# EAGLE design rev_002 (EAGLE 9.6.2)
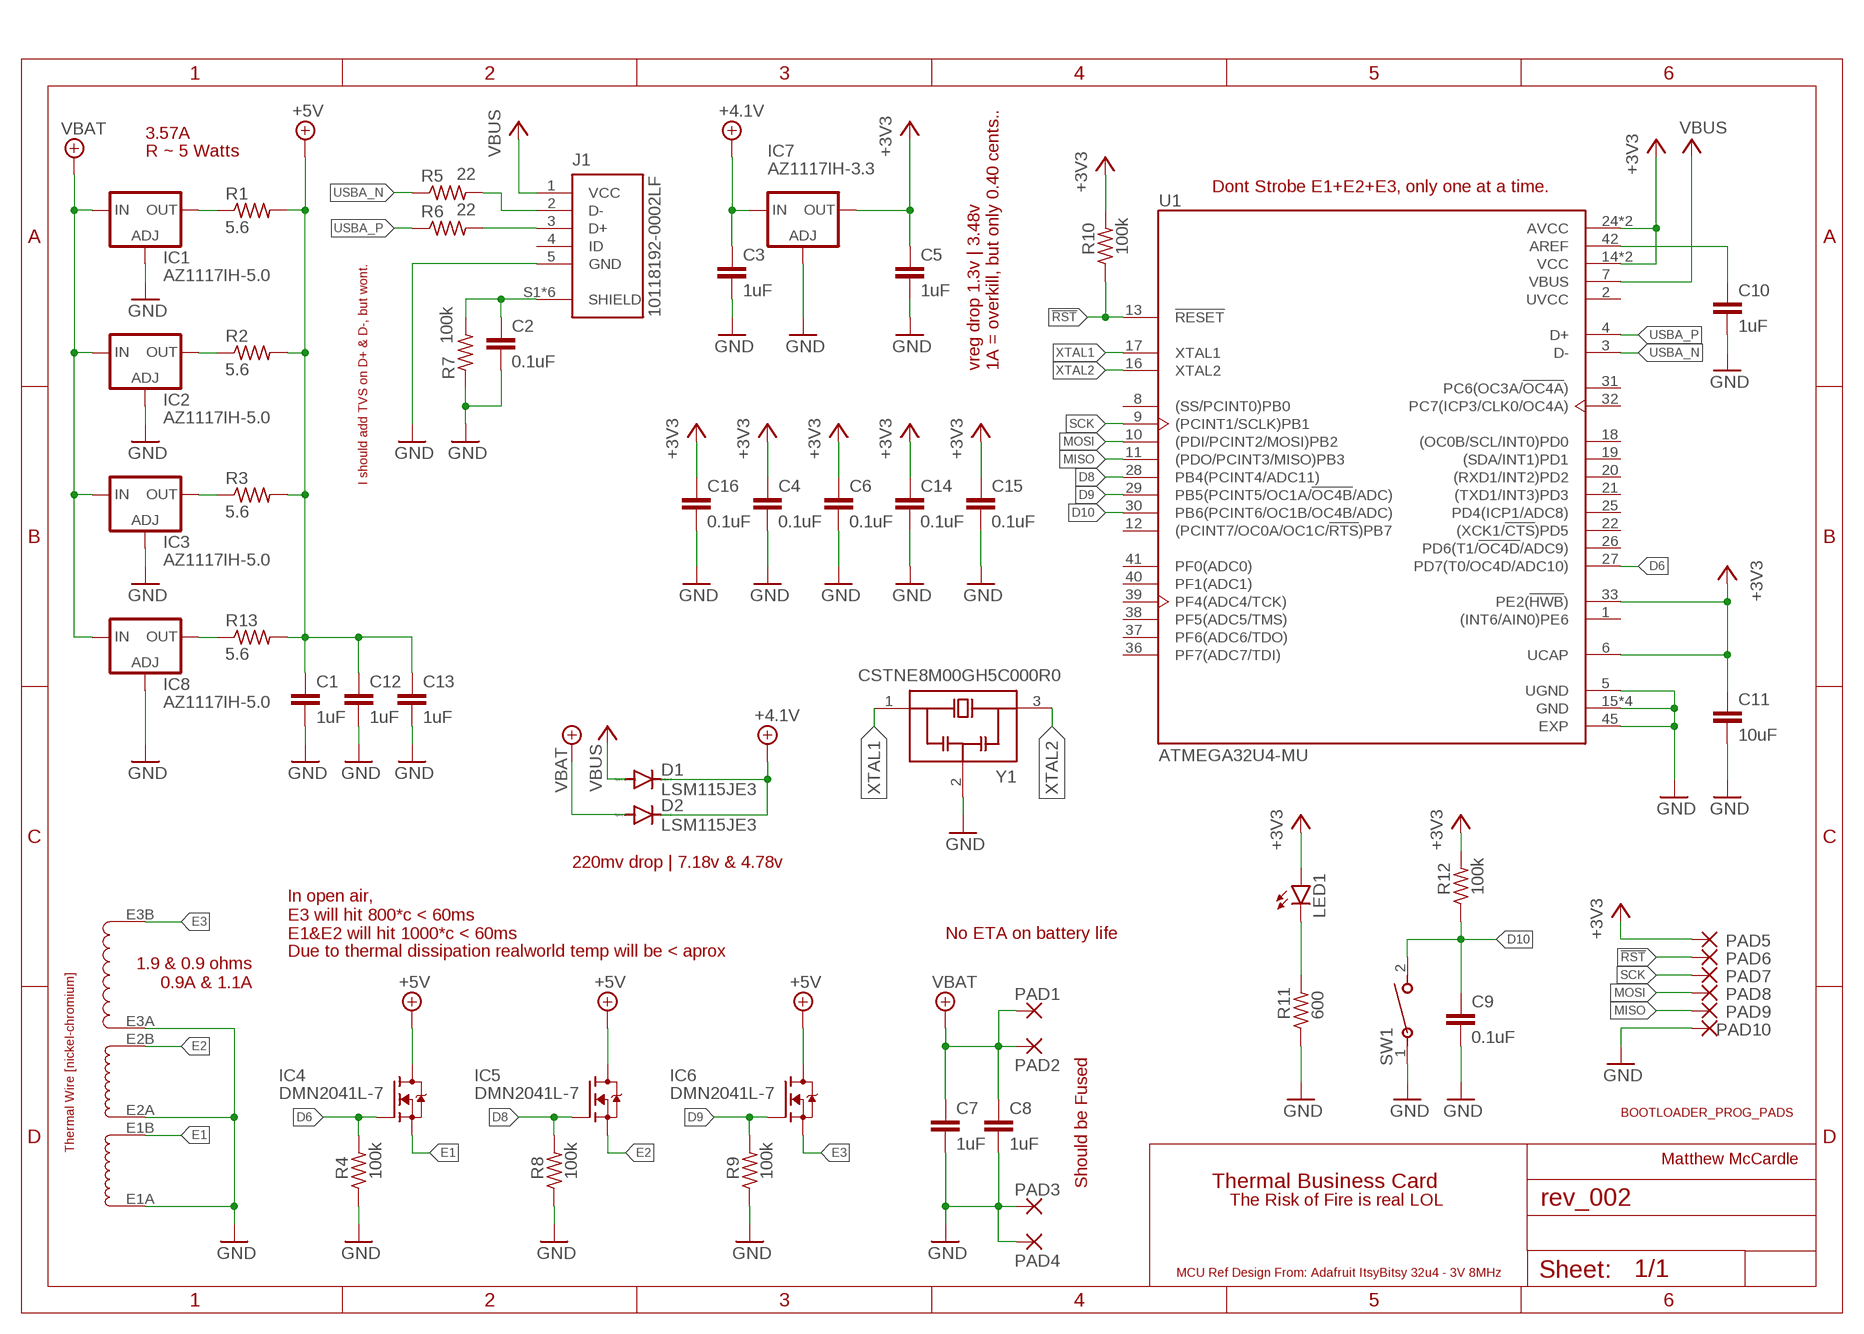
[diagram p0: schematic, sheet 1]

## Parts
C1  1uF  C-EUC0603  [C0603]
C2  0.1uF  C-EUC0603  [C0603]
C3  1uF  C-EUC0603  [C0603]
C4  0.1uF  C-EUC0603  [C0603]
C5  1uF  C-EUC0603  [C0603]
C6  0.1uF  C-EUC0603  [C0603]
C7  1uF  C-EUC0603  [C0603]
C8  1uF  C-EUC0603  [C0603]
C9  0.1uF  C-EUC0603  [C0603]
C10  1uF  C-EUC0603  [C0603]
C11  10uF  C-EUC0603  [C0603]
C12  1uF  C-EUC0603  [C0603]
C13  1uF  C-EUC0603  [C0603]
C14  0.1uF  C-EUC0603  [C0603]
C15  0.1uF  C-EUC0603  [C0603]
C16  0.1uF  C-EUC0603  [C0603]
D1  LSM115JE3  DIODE-DO214BA  [DO214BA]
D2  LSM115JE3  DIODE-DO214BA  [DO214BA]
IC1  AZ1117IH-5.0  AZ1117IH  [SOT223]
IC2  AZ1117IH-5.0  AZ1117IH  [SOT223]
IC3  AZ1117IH-5.0  AZ1117IH  [SOT223]
IC4  DMN2041L-7  DS31126  [SOT23]
IC5  DMN2041L-7  DS31126  [SOT23]
IC6  DMN2041L-7  DS31126  [SOT23]
IC7  AZ1117IH-3.3  AZ1117IH  [SOT223]
IC8  AZ1117IH-5.0  AZ1117IH  [SOT223]
J1  10118192-0002LF  [AMPHENOL_10118192-0002LF]
LED1  LEDSML0603  [SML0603]
NICR1  HOT_WIRE  [LAYOUT_A]
PAD1  WIREPADSMD5-2,5  [5-2,5]
PAD2  WIREPAD2,54/0,9  [2,54/0,9]
PAD3  WIREPAD2,54/0,9  [2,54/0,9]
PAD4  WIREPADSMD5-2,5  [5-2,5]
PAD5  WIREPADSMD1,27-254  [SMD1,27-2,54]
PAD6  WIREPADSMD1,27-254  [SMD1,27-2,54]
PAD7  WIREPADSMD1,27-254  [SMD1,27-2,54]
PAD8  WIREPADSMD1,27-254  [SMD1,27-2,54]
PAD9  WIREPADSMD1,27-254  [SMD1,27-2,54]
PAD10  WIREPADSMD1,27-254  [SMD1,27-2,54]
R1  5.6  R-US_R2512  [R2512]
R2  5.6  R-US_R2512  [R2512]
R3  5.6  R-US_R2512  [R2512]
R4  100k  R-US_R0603  [R0603]
R5  22  R-US_R0603  [R0603]
R6  22  R-US_R0603  [R0603]
R7  100k  R-US_R0603  [R0603]
R8  100k  R-US_R0603  [R0603]
R9  100k  R-US_R0603  [R0603]
R10  100k  R-US_R0603  [R0603]
R11  600  R-US_R0603  [R0603]
R12  100k  R-US_R0603  [R0603]
R13  5.6  R-US_R2512  [R2512]
SW1  B3AL-1000P  [SW_B3AL_OMR]
U1  ATMEGA32U4-MU  [QFN50P700X700X100-45N]
Y1  CSTNE8M00GH5C000R0  [OSC_CSTNE8M00GH5C000R0]

## Nets
!RST: PAD6.1(P) R10.1 U1.13(!RESET!)
+3V3: C4.1 C5.1 C6.1 C11.1 C14.1 C15.1 C16.1 IC7.2(OUT) IC7.4(OUT) LED1.A PAD5.1(P) R10.2 R12.2 U1.6(UCAP) U1.14(VCC) U1.24(AVCC) U1.33(PE2(!HWB!)) U1.34(VCC) U1.44(AVCC)
+4.1V: C3.1 D1.C D2.C IC7.3(IN)
+5V: C1.1 C12.1 C13.1 IC4.D IC5.D IC6.D R1.2 R2.2 R3.2 R13.2
+8V: C7.1 C8.1 D2.A IC1.3(IN) IC2.3(IN) IC3.3(IN) IC8.3(IN) PAD1.1(P) PAD2.1(P) ; supply symbol labelled VBAT
D6: IC4.G R4.2 U1.27(PD7(T0/OC4D/ADC10))
D8: IC5.G R8.2 U1.28(PB4(PCINT4/ADC11))
D9: IC6.G R9.2 U1.29(PB5(PCINT5/OC1A/!OC4B!/ADC))
D10: C9.1 R12.1 SW1.2 U1.30(PB6(PCINT6/OC1B/OC4B/ADC))
E1: IC4.S NICR1.E1B
E2: IC5.S NICR1.E2B
E3: IC6.S NICR1.E3B
GND: C1.2 C2.2 C3.2 C4.2 C5.2 C6.2 C7.2 C8.2 C9.2 C10.2 C11.2 C12.2 C13.2 C14.2 C15.2 C16.2 IC1.1(ADJ) IC2.1(ADJ) IC3.1(ADJ) IC7.1(ADJ) IC8.1(ADJ) J1.5(GND) NICR1.E1A NICR1.E2A NICR1.E3A PAD3.1(P) PAD4.1(P) PAD10.1(P) R4.1 R7.1 R8.1 R9.1 R11.1 SW1.1 U1.5(UGND) U1.15(GND) U1.23(GND) U1.35(GND) U1.43(GND) U1.45(EXP) Y1.2(GND)
MISO: PAD9.1(P) U1.11((PDO/PCINT3/MISO)PB3)
MOSI: PAD8.1(P) U1.10((PDI/PCINT2/MOSI)PB2)
N$1: IC8.2(OUT) IC8.4(OUT) R13.1
N$2: C10.1 U1.42(AREF)
N$4: C2.1 J1.S1(SHIELD) J1.S2(SHIELD) J1.S3(SHIELD) J1.S4(SHIELD) J1.S5(SHIELD) J1.S6(SHIELD) R7.2
N$6: LED1.C R11.2
N$7: IC3.2(OUT) IC3.4(OUT) R3.1
N$9: IC2.2(OUT) IC2.4(OUT) R2.1
N$11: IC1.2(OUT) IC1.4(OUT) R1.1
SCK: PAD7.1(P) U1.9((PCINT1/SCLK)PB1)
USBA_N: R5.1 U1.3(D-)
USBA_P: R6.1 U1.4(D+)
USBB_N: J1.2(D-) R5.2
USBB_P: J1.3(D+) R6.2
VBUS: D1.A J1.1(VCC) U1.7(VBUS)
XTAL1: U1.17(XTAL1) Y1.1(IN)
XTAL2: U1.16(XTAL2) Y1.3(OUT)
Unconnected: J1.4(ID) U1.1((INT6/AIN0)PE6) U1.8((SS/PCINT0)PB0) U1.12((PCINT7/OC0A/OC1C/!RTS!)PB7) U1.18((OC0B/SCL/INT0)PD0) U1.19((SDA/INT1)PD1) U1.20((RXD1/INT2)PD2) U1.21((TXD1/INT3)PD3) U1.22((XCK1/!CTS!)PD5) U1.25(PD4(ICP1/ADC8)) U1.26(PD6(T1/!OC4D!/ADC9)) U1.31(PC6(OC3A/!OC4A!)) U1.32(PC7(ICP3/CLK0/OC4A)) U1.36(PF7(ADC7/TDI)) U1.37(PF6(ADC6/TDO)) U1.38(PF5(ADC5/TMS)) U1.39(PF4(ADC4/TCK)) U1.40(PF1(ADC1)) U1.41(PF0(ADC0))

## Notes on the sheet
- 3.57A
- R ~ 5 Watts
- Dont Strobe E1+E2+E3, only one at a time.
- I should add TVS on D+ & D-, but wont.
- vreg drop 1.3v | 3.48v
  1A = overkill, but only 0.40 cents..
- 220mv drop | 7.18v & 4.78v
- In open air, 
  E3 will hit 800*c < 60ms
  E1&E2 will hit 1000*c < 60ms
- No ETA on battery life
- 1.9 & 0.9 ohms
  0.9A & 1.1A
- Due to thermal dissipation realworld temp will be < aprox
- BOOTLOADER_PROG_PADS
- Thermal Wire [nickel-chromium] | Matthew McCardle
- Should be Fused | Thermal Business Card
- The Risk of Fire is real LOL
- MCU Ref Design From: Adafruit ItsyBitsy 32u4 - 3V 8MHz

## Power pins joined to a net without a drawn wire
UVCC: U1.2(UVCC)

## Library data of the parts
C1-C16 = rcl:C-EU: CAPACITOR, European symbol; SPICEPREFIX: C
D1 D2 = diode:DIODE-: DIODE
IC1-IC3 IC7 IC8 = v-reg-edit:AZ1117IH
IC4-IC6 = ds31126:DS31126
J1 = 10118192-0002LF:10118192-0002LF: USB - micro B USB 2.0 Receptacle Connector 5 Position Surface Mount, Right Angle; DESCRIPTION: Micro USB 2.0, Input Output Connectors, B TYPE RECEPTACLE without flange; DIGI-KEY_PART_NUMBER: 609-5379-1-ND; MF: Amphenol ICC (FCI); MP: 10118192-0002LF; PACKAGE: None; PURCHASE-URL: https://pricing.snapeda.com/search/part/10118192-0002LF/?ref=eda
LED1 = led_edit:LED: LED OSRAM: - CHIPLED LG R971, LG N971, LY N971, LG Q971, LY Q971, LO R971, LY R971 LH N974, LH R974 LS Q976, LO Q976, LY Q976 LO Q996 - Hyper CHIPLED LW Q18S LB Q993, LB Q99A, LB R99A - SideLED LS A670, LO A670, LY A670, LG A670, LP A670 LB A673, LV A673, LT A673, LW A673 LH A674 LY A675 LS A676, LA A676, LO A676, LY A676, LW A676 LS A679, LY A679, LG A679 - Hyper Micro SIDELED® LS Y876, LA Y876, LO Y876, LY Y876 LT Y87S - SmartLED LW L88C, LW L88S LB L89C, LB L89S, LG L890 LS L89K, LO L89K, LY L89K LS L896, LA L896, LO L896, LY L896 - TOPLED LS T670, LO T670, LY T670, LG T670, LP T670 LSG T670, LSP T670, LSY T670, LOP T670, LYG T670 LG T671, LOG T671, LSG T671 LB T673, LV T673, LT T673, LW T673 LH T674 LS T676, LA T676, LO T676, LY T676, LB T676, LH T676, LSB T676, LW T676 LB T67C, LV T67C, LT T67C, LS T67K, LO T67K, LY T67K, LW E67C LS E67B, LA E67B, LO E67B, LY E67B, LB E67C, LV E67C, LT E67C LW T67C LS T679, LY T679, LG T679 LS T770, LO T770, LY T770, LG T770, LP T770 LB T773, LV T773, LT T773, LW T773 LH T774 LS E675, LA E675, LY E675, LS T675 LS T776, LA T776, LO T776, LY T776, LB T776 LHGB T686 LT T68C, LB T68C - Hyper Mini TOPLED® LB M676 - Mini TOPLED Santana® LG M470 LS M47K, LO M47K, LY M47K Source: http://www.osram.convergy.de LUXEON: - LUMILED® LXK2-PW12-R00, LXK2-PW12-S00, LXK2-PW14-U00, LXK2-PW14-V00 LXK2-PM12-R00, LXK2-PM12-S00, LXK2-PM14-U00 LXK2-PE12-Q00, LXK2-PE12-R00, LXK2-PE12-S00, LXK2-PE14-T00, LXK2-PE14-U00 LXK2-PB12-K00, LXK2-PB12-L00, LXK2-PB12-M00, LXK2-PB14-N00, LXK2-PB14-P00, LXK2-PB14-Q00 LXK2-PR12-L00, LXK2-PR12-M00, LXK2-PR14-Q00, LXK2-PR14-R00 LXK2-PD12-Q00, LXK2-PD12-R00, LXK2-PD12-S00 LXK2-PH12-R00, LXK2-PH12-S00 LXK2-PL12-P00, LXK2-PL12-Q00, LXK2-PL12-R00 Source: www.luxeon.com KINGBRIGHT: KA-3528ASYC Source: www.kingbright.com
NICR1 = logo_wire:HOT_WIRE
PAD1-PAD10 = wirepad:WIREPAD: Wire PAD connect wire on PCB
R1-R13 = rcl:R-US_: RESISTOR, American symbol; SPICEPREFIX: R
SW1 = ul_B3AL-1000P:B3AL-1000P; COPYRIGHT: Copyright (C) 2021 Ultra Librarian. All rights reserved.; DIGI-KEY_PART_NUMBER_1: SW1216TR-ND; DIGI-KEY_PART_NUMBER_2: SW1216CT-ND; DIGI-KEY_PART_NUMBER_3: SW1216DKR-ND; MANUFACTURER_PART_NUMBER: B3AL-1000P; MFR_NAME: Omron
U1 = ATMEGA32U4-MU:ATMEGA32U4-MU: 8-bit Microcontrollers - MCU AVR USB 32K FLASH INDUSTRIA; DESCRIPTION: AVR AVR® ATmega Microcontroller IC 8-Bit 16MHz 32KB (16K x 16) FLASH 44-VQFN (7x7); DIGI-KEY_PART_NUMBER: 2156-ATMEGA32U4-MUR-ND; MF: Microchip Technology / Atmel; MP: ATMEGA32U4-MU; PACKAGE: VFQFN-44 Microchip Technology / Atmel; PURCHASE-URL: https://pricing.snapeda.com/search/part/ATMEGA32U4-MU/?ref=eda
Y1 = CSTNE8M00GH5C000R0:CSTNE8M00GH5C000R0: 8MHz Ceramic Resonator Built in Capacitor 33pF ±0.13% 40 Ohms -40°C ~ 125°C Surface Mount; DESCRIPTION: 8 MHz Ceramic Resonator Built in Capacitor 33 pF ±0.13% 40 Ohms -40°C ~ 125°C Surface Mount; DIGI-KEY_PART_NUMBER: 490-17961-1-ND; MF: Murata; MP: CSTNE8M00GH5C000R0; PACKAGE: SMD-3 Murata; PURCHASE-URL: https://pricing.snapeda.com/search/part/CSTNE8M00GH5C000R0/?ref=eda

## Board
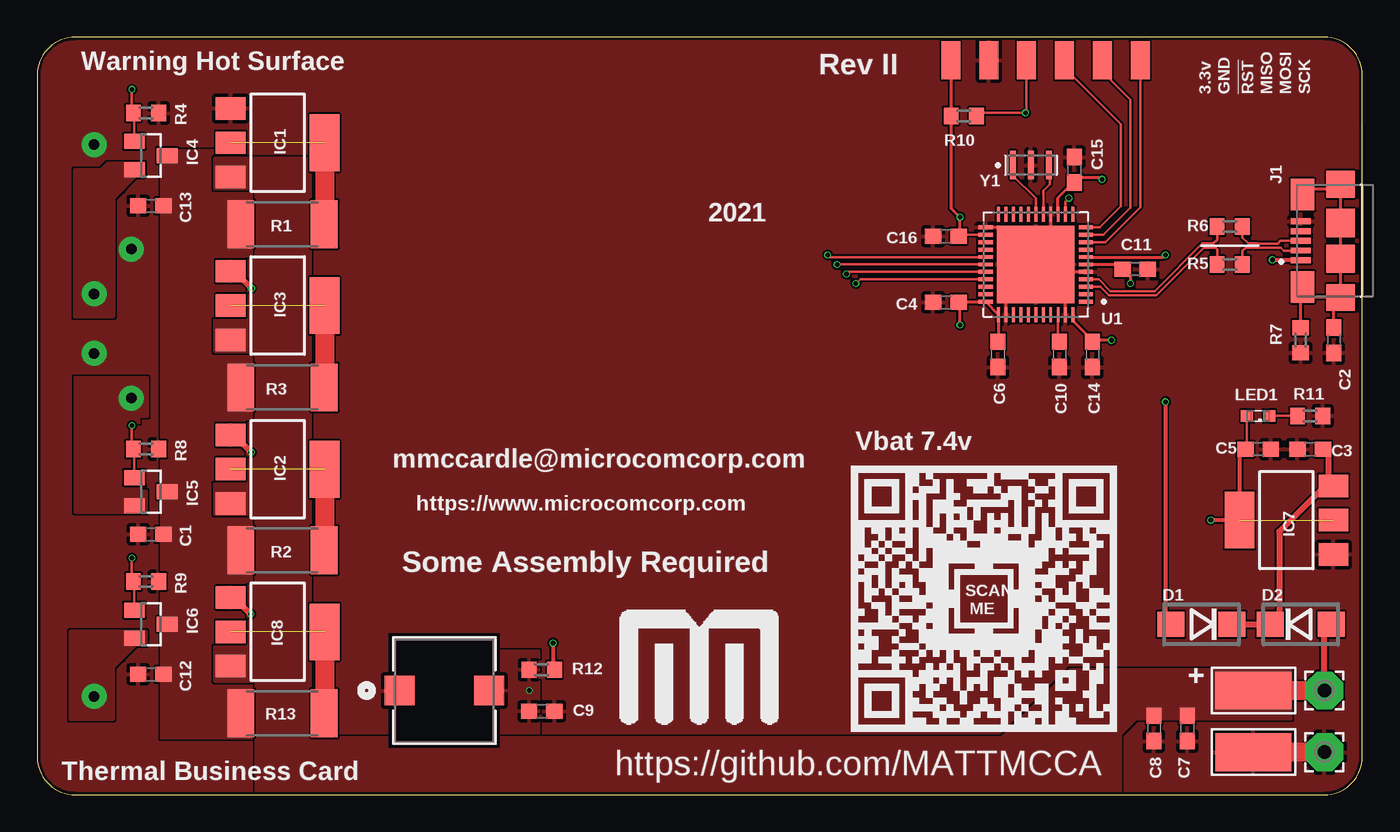
[diagram p1: board, top side]
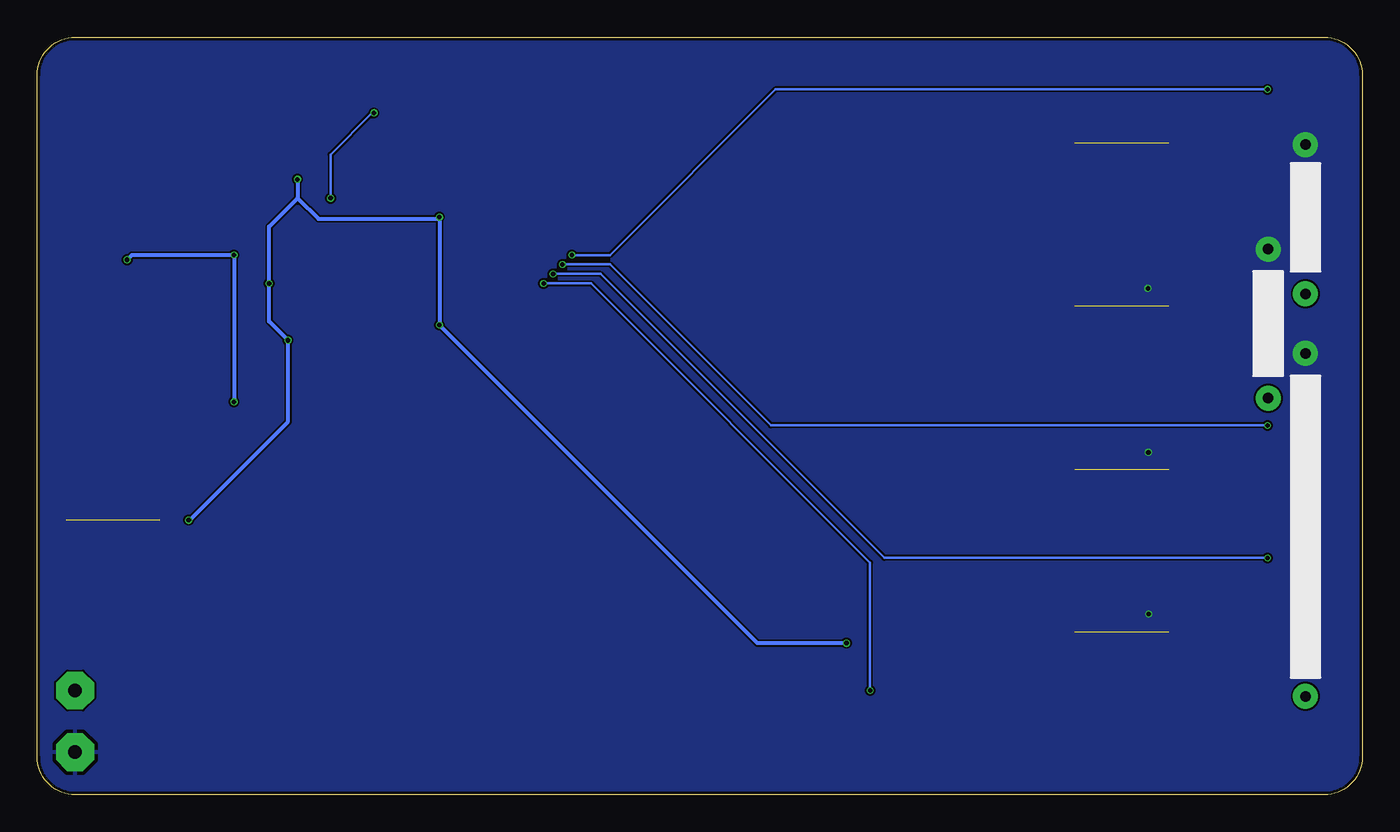
[diagram p2: board, bottom side, seen from below]

Size 88.9 x 50.8 mm. Coordinates in mm from the lower left corner, seen from the top.
Outline: 0,48.26 0,2.54 arc90 2.54,0 86.36,0 arc90 88.9,2.54 88.9,48.26 arc90 86.36,50.8 2.54,50.8 arc90 0,48.26
Copper layers (1*16): Top 0.035mm / dielectric 1.6mm / Bottom 0.035mm
Design rules "jlcpcb-2layers_tinted_vias": minimum track width 5mil, minimum drill 0.3mm, track to track 5mil, track to pad 5mil, pad to pad 5mil, via to via 5mil, smd to smd 5mil, copper to edge 0.2mm, drill to drill 6mil, minimum pad ring 10mil, minimum via ring 3mil, stop-mask expansion 4mil, vias tented up to drill 20mil, thermal gap 10mil

### Footprints (pad centres in the part's own frame; a part is rotated, then mirrored left to right if it is on the bottom)
C0603 = smd 1.1 x 1: 1 -0.85,0; 2 0.85,0
DO214BA = smd 1.8 x 1.7: A 2.05,0; C -2.05,0
SOT223 = smd 1.5 x 2: 1 -2.3,-3.15; 2 0,-3.15; 3 2.3,-3.15 | smd 3.8 x 2: 4 0,3.15
SOT23 = smd 1 x 1.4: D 0,1.1; G -0.95,-1.1; S 0.95,-1.1
AMPHENOL_10118192-0002LF = smd 0.4 x 1.35: 1 -1.3,0; 2 -0.65,0; 3 0,0; 4 0.65,0; 5 1.3,0 | smd 2.1 x 1.6: S1 -3.1,-0.125; S2 3.1,-0.125 | smd 1.8 x 1.9: S3 -3.8,-2.675; S6 3.8,-2.675 | smd 1.9 x 1.9: S4 -1.2,-2.675; S5 1.2,-2.675
SML0603 = smd 0.8 x 0.8: A 0.75,0; C -0.75,0
LAYOUT_A = drill 0.7 pad 1.676: E1A 0,13.75; E1B 0,3.75; E2A 2.5,6.75; E2B 2.5,-3.25; E3A 0,-0.25; E3B 0,-23.25
5-2,5 = smd 2.54 x 5.08: 1 0,0
2,54/0,9 = drill 0.914 pad 2.54 octagon: 1 0,0
SMD1,27-2,54 = smd 1.27 x 2.54: 1 0,0
R2512 = smd 1.8 x 3.2: 1 -2.8,0; 2 2.8,0
R0603 = smd 1 x 1.1: 1 -0.85,0; 2 0.85,0
SW_B3AL_OMR = smd 2.007 x 2.007: 1 -3,0; 2 3,0
QFN50P700X700X100-45N = smd 1.01 x 0.26: 1 -3.36,2.5; 2 -3.36,2; 3 -3.36,1.5; 4 -3.36,1; 5 -3.36,0.5; 6 -3.36,0; 7 -3.36,-0.5; 8 -3.36,-1; 9 -3.36,-1.5; 10 -3.36,-2; 11 -3.36,-2.5; 23 3.36,-2.5; 24 3.36,-2; 25 3.36,-1.5; 26 3.36,-1; 27 3.36,-0.5; 28 3.36,0; 29 3.36,0.5; 30 3.36,1; 31 3.36,1.5; 32 3.36,2; 33 3.36,2.5 | smd 0.26 x 1.01: 12 -2.5,-3.36; 13 -2,-3.36; 14 -1.5,-3.36; 15 -1,-3.36; 16 -0.5,-3.36; 17 0,-3.36; 18 0.5,-3.36; 19 1,-3.36; 20 1.5,-3.36; 21 2,-3.36; 22 2.5,-3.36; 34 2.5,3.36; 35 2,3.36; 36 1.5,3.36; 37 1,3.36; 38 0.5,3.36; 39 0,3.36; 40 -0.5,3.36; 41 -1,3.36; 42 -1.5,3.36; 43 -2,3.36; 44 -2.5,3.36 | smd 5.2 x 5.2: 45 0,0
OSC_CSTNE8M00GH5C000R0 = smd 0.4 x 1.9: 1 -1.2,0; 2 0,0; 3 1.2,0

### Placement (x,y rotation side)
C1  7.62,17.46 180 top
C2  87,30.48 270 top
C3  85.41,23.18 180 top
C4  60.96,33.02 180 top
C5  81.92,23.18 0 top
C6  64.45,29.53 270 top
C7  77.15,4.45 270 top
C8  74.93,4.45 270 top
C9  33.85,5.59 0 top
C10  68.58,29.53 270 top
C11  73.66,35.24 0 top
C12  7.62,8.06 180 top
C13  7.62,39.5 180 top
C14  70.8,29.53 270 top
C15  69.6,41.91 90 top
C16  60.96,37.47 180 top
D1  78.11,11.43 180 top
D2  84.77,11.43 0 top
IC1  16.13,43.73 270 top
IC2  16.13,21.83 270 top
IC3  16.13,32.8 270 top
IC4  7.62,42.86 270 top
IC5  7.62,20.32 270 top
IC6  7.62,11.43 270 top
IC7  83.82,18.41 90 top
IC8  16.13,10.92 270 top
J1  84.77,37.15 90 top
LED1  81.92,25.4 180 top
NICR1  3.81,29.84 0 top
PAD1  81.6,6.99 90 top
PAD2  86.36,6.99 90 top
PAD3  86.36,2.86 90 top
PAD4  81.6,2.86 90 top
PAD5  61.3,49.25 180 top
PAD6  66.38,49.25 180 top
PAD7  74,49.25 0 top
PAD8  71.46,49.25 0 top
PAD9  68.92,49.25 0 top
PAD10  63.84,49.25 180 top
R1  16.46,38.27 180 top
R2  16.46,16.4 180 top
R3  16.46,27.32 180 top
R4  7.3,45.72 180 top
R5  80.01,35.56 0 top
R6  80.01,38.1 0 top
R7  84.77,30.48 90 top
R8  7.3,23.18 180 top
R9  7.3,14.29 180 top
R10  62.17,45.53 180 top
R11  85.41,25.4 180 top
R12  33.85,8.38 0 top
R13  16.46,5.46 180 top
SW1  27.3,6.99 0 top
U1  66.99,35.56 180 top
U$1  [LINK_INV]  54.64,4.27 0 top
U$2  [MCOM]  38.73,4.13 0 top
Y1  66.67,42.23 0 top

### Tracks (layer width: path | path; a pad name or v marks a point on that pad's centre or on a via)
!RST  (via drill 0.3)
  Top 0.152: U1.13 68.99,39.78 v69.22,40.01 | R10.1 63.22,45.73 v66.31,45.73 66.38,45.81 PAD6.1
  Bottom 0.152: v69.22,40.01 v69.23,40.02 69.23,42.93 66.42,45.73 v66.31,45.73
+3V3  (via drill 0.3)  (1 unrouted)
  Top 0.152: U1.24 61.91,37.56 C16.1 61.91,37.47 | C14.1 70.8,30.48 | 69.53,41.06 C15.1 69.91,41.38 | 80.67,22.78 C5.1 81.17,23.28 LED1.A | 72.76,35.29 C11.1 | C4.1 61.81,32.8 61.91,32.7
  Top 0.203: U1.14 68.49,40.02 69.53,41.06 | 61.28,49.21 PAD5.1 61.3,45.55 R10.2 61.32,39.33 v61.91,38.73 61.91,37.47 | v71.44,41.27 71.33,41.38 69.91,41.38 | v61.91,31.5 61.91,32.7 | U1.44 69.53,32.16 69.53,31.75 70.8,30.48 v72.07,30.48 | C4.1 61.85,33.06 U1.33 U1.34 64.49,30.42 C6.1 | U1.6 72.49,35.56 72.76,35.29 | C11.1 73.34,34.71 v73.34,34.29
  Top 0.254: 80.67,22.78 IC7.4 v78.74,18.41 | v34.61,10.16 34.61,8.47 R12.2
  Bottom 0.152: 71.44,40.01 71.41,40.01
  Bottom 0.203: v61.91,38.73 62.03,38.62 | v78.74,18.41 78.68,18.41
  Bottom 0.254: 71.41,40.01 70.03,38.62 62.03,38.62 | v61.91,38.73 v61.91,31.5 40.58,10.16 v34.61,10.16 | v71.44,41.27 71.44,40.01 73.34,38.1 v73.34,34.29 73.34,31.75 v72.07,30.48 72.07,25.02 78.68,18.41
+4.1V
  Top 0.203: IC7.3 86.63,20.37 86.63,20.68 | C3.1 86.63,22.81
  Top 0.406: D1.C D2.C 83.33,12.04 83.33,17.64 86.63,20.93 | 86.63,22.81 86.63,20.93 | 86.63,20.93 86.63,20.68
+5V
  Top 0.152: 8.89,11.43 IC6.D | 8.47,20.07 IC5.D
  Top 0.203: 8.72,17.71 C1.1
  pour Top (rank 2, no thermals): 8.38,43.18 14.48,43.18 14.48,3.81 8.38,3.81
+8V
  Top 0.152: C7.1 76.96,5.49
  Top 0.203: 86.36,10.97 D2.A
  Top 0.406: PAD2.1 86.36,10.97
  Top 1.27: PAD2.1 PAD1.1
  pour Top (no thermals): 11.94,42.67 18.29,42.67 18.29,4.77 19.25,3.81 64.77,3.81 69.34,8.38 84.07,8.38 84.07,5.08 73.66,5.08 72.64,4.06 72.64,0.25 14.73,0.25 14.73,7.62 11.94,7.62 11.94,13.97 14.73,13.97 14.73,18.8 11.94,18.8 11.94,24.89 14.73,24.89 14.73,29.72 11.94,29.72 11.94,35.81 14.73,35.81 14.73,40.64 11.94,40.64
D6  (via drill 0.3)
  Top 0.152: U1.27 53.16,36.06 v53.02,36.2 | IC4.G 6.52,45.65 R4.2 6.35,45.82 v6.35,47.31
  Bottom 0.152: v6.35,47.31 39.37,47.31 50.48,36.2 v53.02,36.2
D8  (via drill 0.3)
  Top 0.152: U1.28 v53.66,35.56 | IC5.G 6.52,23.11 R8.2 6.35,23.28 v6.35,24.77
  Bottom 0.152: v6.35,24.77 39.69,24.77 50.48,35.56 v53.66,35.56
D9  (via drill 0.3)
  Top 0.152: IC6.G 6.52,14.22 R9.2 6.35,14.39 v6.35,15.88 | U1.29 54.43,35.06 v54.29,34.92
  Bottom 0.152: v6.35,15.88 32.07,15.88 51.12,34.92 v54.29,34.92
D10  (via drill 0.3)
  Top 0.152: U1.30 55.24,34.56 54.98,34.29 v54.93,34.29
  Bottom 0.152: v33.02,6.99 33.02,15.56 51.75,34.29 v54.93,34.29
  pour Top (rank 4): 28.57,9.65 33.66,9.65 33.66,4.06 28.57,4.06
E1
  pour Top (rank 4, no thermals): 4.76,42.35 7.11,42.35 7.11,41.53 6.6,41.53 5.08,40.01 5.08,32.07 2.54,32.07 2.54,41.91 4.32,41.91
E2
  pour Top (no thermals): 2.54,18.99 7.3,18.99 7.3,20.32 6.79,20.32 6.79,25.4 7.37,25.4 7.37,27.94 2.54,27.94
E3
  pour Top (rank 4, no thermals): 2.22,5.08 5.08,5.08 5.08,8.57 6.6,10.1 7.3,10.1 7.3,10.92 2.22,10.92
GND  (via drill 0.3)
  Top 0.152: U1.15 67.99,36.24 67.63,35.88 | 67.31,35.56 U1.45 67.49,35.06 | 67.63,35.88 67.31,35.56 | U1.5 67.49,35.06 | U1.43 68.99,33.56 67.49,35.06 | U1.35 64.99,33.24 67.31,35.56 | U1.23 65.44,38.06 67.63,35.88
  Top 0.254: 13.28,35.05 13.03,35.05 IC3.1 | IC8.1 13.22,13.22
  Top 0.406: v14.38,33.96 13.28,35.05 | v14.35,22.96 13.18,24.13 IC2.1 | v14.33,12.12 13.22,13.22
  Top 1.27: PAD3.1 PAD4.1
  pour Top (rank 5): 86.36,0 2.54,0 arc-90 0,2.54 0,48.26 arc-90 2.54,50.8 86.36,50.8 arc-90 88.9,48.26 88.9,2.54 arc-90
  pour Bottom (rank 5): 2.54,50.8 86.36,50.8 arc-90 88.9,48.26 88.9,2.54 arc-90 86.36,0 2.54,0 arc-90 0,2.54 0,48.26 arc-90
  pour Top (rank 6, no thermals): 5.08,37.78 5.08,35.56 7.3,35.56 7.3,37.78
  pour Top (rank 6, no thermals): 2.54,44.77 2.54,42.55 5.08,42.55 5.08,44.77
  pour Top (rank 6, no thermals): 2.54,30.8 2.54,28.57 5.08,28.57 5.08,30.8
  pour Bottom (no thermals): 2.29,45.47 2.29,42.16 5.33,42.16 5.33,45.47
  pour Bottom (no thermals): 4.83,37.85 4.83,34.8 7.87,34.8 7.87,38.35 4.83,38.35
  pour Bottom (no thermals): 2.29,30.73 2.29,27.69 5.33,27.69 5.33,31.24 2.29,31.24
MISO
  Top 0.152: U1.11 71.31,38.06 72.71,39.46 72.71,44.96 68.92,48.75 PAD9.1
MOSI
  Top 0.152: U1.10 71.53,37.56 73.34,39.37 73.34,46.61 71.46,48.49 PAD8.1
N$1  (1 unrouted)
  Top 0.203: 19.28,5.48 R13.1
  Top 1.27: IC8.4 19.28,5.48
N$2
  Top 0.152: U1.42 68.49,30.46 C10.1
N$4
  Top 0.152: J1.S1 84.77,33.92 85.35,33.35 | 87,32.9 J1.S3 | 87.45,40.64 J1.S6 | J1.S2 85.29,40.64
  Top 0.203: R7.2 84.77,33.92 | C2.1 87,32.9 | 85.29,40.64 87.45,40.64 J1.S5 J1.S4 J1.S3 85.35,33.35
N$6
  Top 0.152: R11.2 LED1.C
N$7  (1 unrouted)
  Top 0.203: 19.28,27.34 R3.1
  Top 1.27: IC3.4 19.28,27.34
N$9  (1 unrouted)
  Top 0.203: 19.28,16.42 R2.1
  Top 1.27: IC2.4 19.28,16.42
N$11  (1 unrouted)
  Top 0.203: 19.28,38.28 R1.1
  Top 1.27: IC1.4 19.28,38.28
SCK
  Top 0.152: U1.9 71.66,37.06 74,39.4 PAD7.1
USBA_N
  Top 0.152: R5.1 79.16,36.6 79.07,36.69 78.29,36.69 75.1,33.5 71.9,33.5 71.34,34.06 U1.3
USBA_P
  Top 0.152: R6.1 79.16,37.21 78.92,36.97 78.17,36.97 74.98,33.78 72.02,33.78 71.24,34.56 U1.4
USBB_N
  Top 0.152: R5.2 80.86,36.47 81.08,36.69 81.73,36.69 81.74,36.68 83.44,36.68 83.63,36.5 J1.2
USBB_P
  Top 0.152: R6.2 80.86,37.35 81.24,36.97 81.85,36.97 81.86,36.96 83.22,36.96 83.4,37.15 J1.3
VBUS  (via drill 0.3)
  Top 0.203: D1.A 75.69,11.79 | 82.9,35.85 v82.87,35.88 | U1.7 75.56,36.06 v75.69,36.2
  Top 0.254: v75.69,26.35 75.69,11.79 | J1.1 82.9,35.85
  Bottom 0.254: v75.69,26.35 v75.69,36.2 82.55,36.2 v82.87,35.88
XTAL1
  Top 0.152: U1.17 66.99,40.01 65.47,41.52 Y1.1
XTAL2
  Top 0.152: U1.16 67.49,40.51 67.94,40.96 67.94,42.16 Y1.3

### Text on the board
tPlace: Warning Hot Surface | Rev II | 3.3v | GND | !RST | MISO | MOSI | SCK | 2021 | Vbat 7.4v | mmccardle@microcomcorp.com | https://www.microcomcorp.com | Some Assembly Required | SCAN / ME | + | Thermal Business Card | https://github.com/MATTMCCA
tStop: Matthew / McCardle | Microcom Corporation | Support Engineer | Work: 740-548-6262 | Cell: 740-975-3595